# EAGLE schematic MIDI-v1a (EAGLE 5.03)
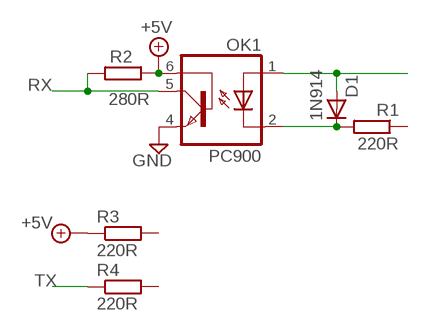
[diagram p0: schematic, sheet 1]

## Parts
D1  1N914  1N4148DO35-7  [DO35-7]
OK1  PC900  PC110  [DIL06]
R1  220R  R-EU_0204/7  [0204/7]
R2  280R  R-EU_0204/7  [0204/7]
R3  220R  R-EU_0204/7  [0204/7]
R4  220R  R-EU_0204/7  [0204/7]

## Nets
+5V: OK1.6(BAS) R2.1 R3.1
GND: OK1.4(EMI)
N$1: D1.C OK1.2(C) R1.2
N$2: D1.A OK1.1(A)
RX: OK1.5(COL) R2.2
TX: R4.1
Unconnected: R1.1 R3.2 R4.2

## Library data of the parts
D1 = diode:1N4148: DIODE high speed (Philips)
OK1 = optocoupler:PC110: SHARP OPTO COUPLER
R1-R4 = rcl:R-EU_: RESISTOR, European symbol